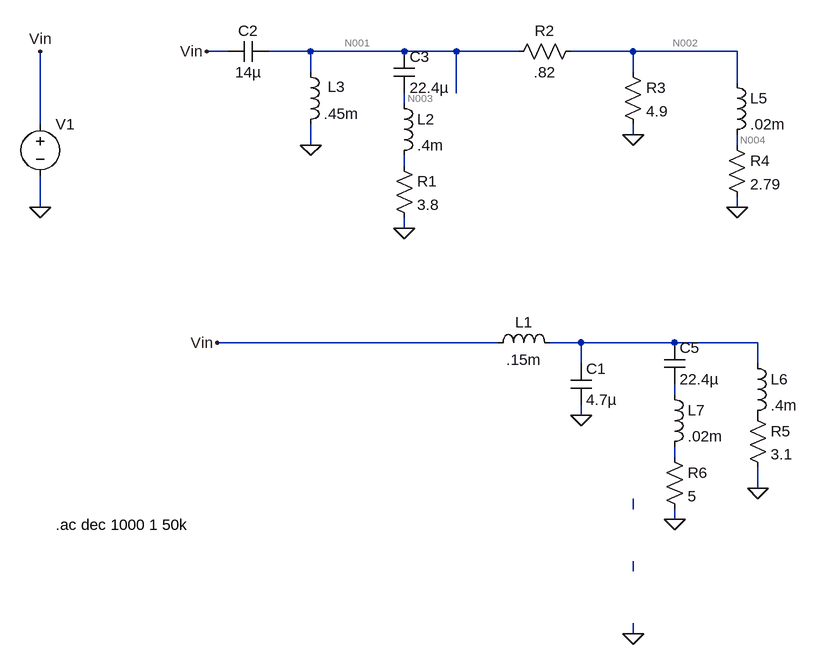
[diagram p0: schematic Crossover Design.asc]
Crossover Design.asc, the LTspice schematic file:
Version 4
SHEET 1 948 992
WIRE 0 64 -32 64
WIRE 128 64 64 64
WIRE 272 64 128 64
WIRE 352 64 272 64
WIRE 448 64 352 64
WIRE 624 64 528 64
WIRE 784 64 624 64
WIRE 128 96 128 64
WIRE 624 96 624 64
WIRE 784 112 784 64
WIRE 352 128 352 64
WIRE 272 144 272 128
WIRE -288 176 -288 64
WIRE 624 192 624 176
WIRE 128 208 128 176
WIRE 784 208 784 192
WIRE 272 240 272 224
WIRE -288 304 -288 256
WIRE 784 304 784 288
WIRE 272 336 272 320
WIRE 416 512 -16 512
WIRE 544 512 496 512
WIRE 688 512 544 512
WIRE 816 512 688 512
WIRE 544 544 544 512
WIRE 816 544 816 512
WIRE 688 592 688 576
WIRE 544 624 544 608
WIRE 688 688 688 672
WIRE 816 736 816 704
WIRE 624 768 624 752
WIRE 688 784 688 768
WIRE 624 864 624 848
WIRE 624 960 624 944
FLAG 624 192 0
FLAG 128 208 0
FLAG 784 304 0
FLAG -288 304 0
FLAG 544 624 0
FLAG 816 736 0
FLAG -288 64 Vin
FLAG -32 64 Vin
FLAG -16 512 Vin
FLAG 688 784 0
FLAG 624 960 0
FLAG 272 336 0
SYMBOL res 544 48 R90
WINDOW 0 0 56 VBottom 2
WINDOW 3 32 56 VTop 2
SYMATTR InstName R2
SYMATTR Value .82
SYMBOL res 608 80 R0
SYMATTR InstName R3
SYMATTR Value 4.9
SYMBOL cap 528 544 R0
SYMATTR InstName C1
SYMATTR Value 4.7µ
SYMBOL cap 64 48 R90
WINDOW 0 0 32 VBottom 2
WINDOW 3 32 32 VTop 2
SYMATTR InstName C2
SYMATTR Value 14µ
SYMBOL res 768 192 R0
SYMATTR InstName R4
SYMATTR Value 2.79
SYMBOL res 800 608 R0
SYMATTR InstName R5
SYMATTR Value 3.1
SYMBOL ind 400 528 R270
WINDOW 0 32 56 VTop 2
WINDOW 3 5 56 VBottom 2
SYMATTR InstName L1
SYMATTR Value .15m
SYMATTR SpiceLine Rser=.21
SYMBOL ind 112 80 R0
WINDOW 0 42 38 Left 2
SYMATTR InstName L3
SYMATTR Value .45m
SYMATTR SpiceLine Rser=.15
SYMBOL ind 768 96 R0
SYMATTR InstName L5
SYMATTR Value .02m
SYMBOL ind 800 528 R0
SYMATTR InstName L6
SYMATTR Value .4m
SYMBOL voltage -288 160 R0
SYMATTR InstName V1
SYMATTR Value ""
SYMATTR Value2 AC 1
SYMBOL res 672 672 R0
SYMATTR InstName R6
SYMATTR Value 5
SYMBOL cap 672 512 R0
SYMATTR InstName C5
SYMATTR Value 22.4µ
SYMBOL ind 672 576 R0
SYMATTR InstName L7
SYMATTR Value .02m
SYMATTR SpiceLine Rser=.21
SYMBOL res 256 224 R0
SYMATTR InstName R1
SYMATTR Value 3.8
SYMBOL cap 256 64 R0
SYMATTR InstName C3
SYMATTR Value 22.4µ
SYMBOL ind 256 128 R0
SYMATTR InstName L2
SYMATTR Value .4m
SYMATTR SpiceLine Rser=.21
TEXT -264 792 Left 2 !.ac dec 1000 1 50k

The netlist it stands for:
* Crossover Design.asc
R2 N002 N001 .82
R3 N002 0 4.9
C1 N006 0 4.7µ
C2 N001 Vin 14µ
R4 N004 0 2.79
R5 P001 0 3.1
L1 Vin N006 .15m Rser=.21
L3 N001 0 .45m Rser=.15
L5 N002 N004 .02m
L6 N006 P001 .4m
V1 Vin 0 AC 1
R6 N008 0 5
C5 N006 N007 22.4µ
L7 N007 N008 .02m Rser=.21
R1 N005 0 3.8
C3 N001 N003 22.4µ
L2 N003 N005 .4m Rser=.21
.ac dec 1000 1 50k
.backanno
.end

* Results of the author's LTspice run, read from the files saved beside the schematic
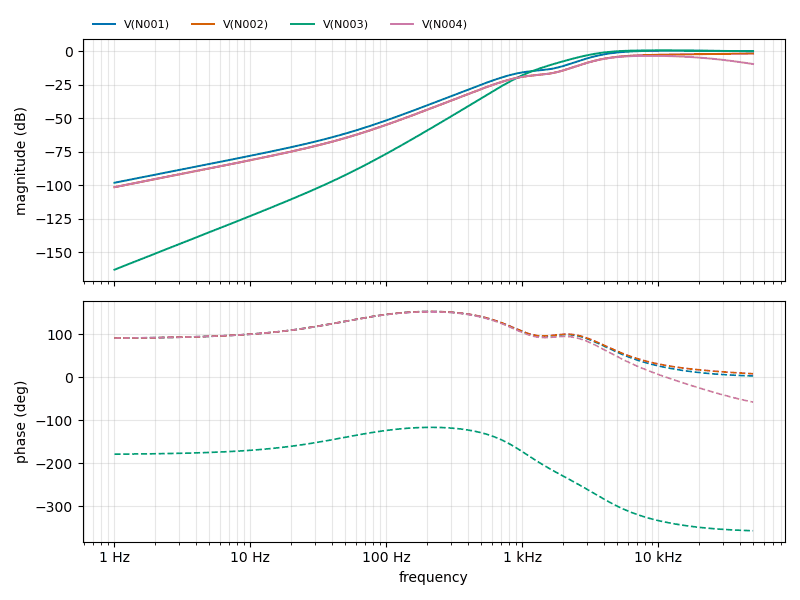
[diagram p1: AC Analysis of Crossover Design.asc, plotted from the saved traces]
* AC Analysis, 1 run:
*   V(N001): -98.08 dB at 1 Hz, 0.20 dB at 50 kHz, peak 0.62 dB at 13.21 kHz, 3 dB below the peak at 3.882 kHz
*   V(N002): -101.37 dB at 1 Hz, -1.54 dB at 50 kHz, peak -1.54 dB at 50 kHz, 3 dB below the peak at 4.501 kHz
*   V(N003): -163.05 dB at 1 Hz, 0.21 dB at 50 kHz, peak 0.81 dB at 9.594 kHz, 3 dB below the peak at 3.231 kHz
*   V(N004): -101.37 dB at 1 Hz, -9.37 dB at 50 kHz, peak -3.22 dB at 8.71 kHz, 3 dB below the peak at 3.685 kHz and 29.79 kHz